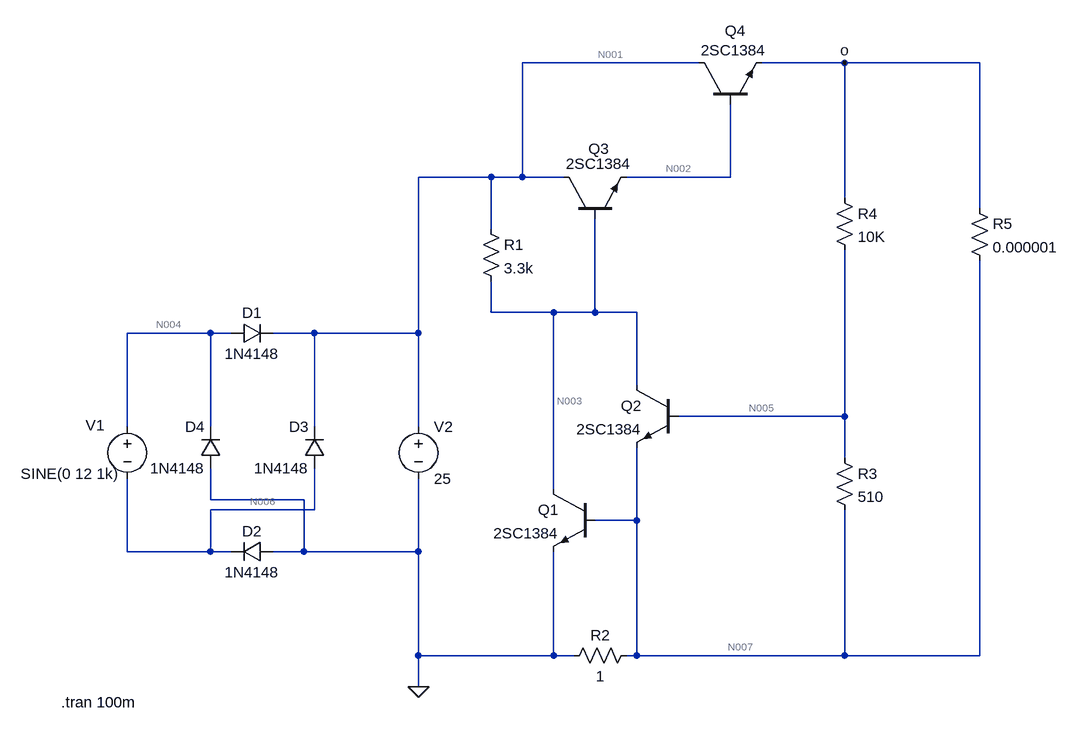
[diagram p0: schematic Draft2.asc]
Draft2.asc, the LTspice schematic file:
Version 4
SHEET 1 1492 680
WIRE 928 -416 656 -416
WIRE 1152 -416 1024 -416
WIRE 1360 -416 1152 -416
WIRE 608 -240 496 -240
WIRE 656 -240 656 -416
WIRE 656 -240 608 -240
WIRE 720 -240 656 -240
WIRE 976 -240 976 -352
WIRE 976 -240 816 -240
WIRE 1152 -208 1152 -416
WIRE 1360 -192 1360 -416
WIRE 608 -160 608 -240
WIRE 608 -32 608 -80
WIRE 704 -32 608 -32
WIRE 768 -32 768 -176
WIRE 768 -32 704 -32
WIRE 832 -32 768 -32
WIRE 176 0 48 0
WIRE 208 0 176 0
WIRE 336 0 272 0
WIRE 496 0 496 -240
WIRE 496 0 336 0
WIRE 832 80 832 -32
WIRE 1152 128 1152 -128
WIRE 1152 128 896 128
WIRE 48 144 48 0
WIRE 176 144 176 0
WIRE 336 144 336 0
WIRE 496 144 496 0
WIRE 1152 192 1152 128
WIRE 704 240 704 -32
WIRE 176 256 176 208
WIRE 320 256 176 256
WIRE 336 272 336 208
WIRE 336 272 176 272
WIRE 832 288 832 176
WIRE 832 288 768 288
WIRE 48 336 48 224
WIRE 176 336 176 272
WIRE 176 336 48 336
WIRE 208 336 176 336
WIRE 320 336 320 256
WIRE 320 336 272 336
WIRE 496 336 496 224
WIRE 496 336 320 336
WIRE 496 496 496 336
WIRE 704 496 704 336
WIRE 704 496 496 496
WIRE 736 496 704 496
WIRE 832 496 832 288
WIRE 832 496 816 496
WIRE 1152 496 1152 272
WIRE 1152 496 832 496
WIRE 1360 496 1360 -112
WIRE 1360 496 1152 496
WIRE 496 544 496 496
FLAG 496 544 0
FLAG 1152 -416 o
SYMBOL diode 208 16 R270
WINDOW 0 32 32 VTop 2
WINDOW 3 0 32 VBottom 2
SYMATTR InstName D1
SYMATTR Value 1N4148
SYMBOL diode 192 208 R180
WINDOW 0 24 64 Left 2
WINDOW 3 24 0 Left 2
SYMATTR InstName D4
SYMATTR Value 1N4148
SYMBOL diode 352 208 R180
WINDOW 0 24 64 Left 2
WINDOW 3 24 0 Left 2
SYMATTR InstName D3
SYMATTR Value 1N4148
SYMBOL diode 272 320 R90
WINDOW 0 0 32 VBottom 2
WINDOW 3 32 32 VTop 2
SYMATTR InstName D2
SYMATTR Value 1N4148
SYMBOL voltage 496 128 R0
WINDOW 123 0 0 Left 0
WINDOW 39 0 0 Left 0
SYMATTR InstName V2
SYMATTR Value 25
SYMBOL npn 720 -176 R270
WINDOW 0 108 38 VRight 2
WINDOW 3 85 3 VRight 2
SYMATTR InstName Q3
SYMATTR Value 2SC1384
SYMBOL res 592 -176 R0
SYMATTR InstName R1
SYMATTR Value 3.3k
SYMBOL res 832 480 R90
WINDOW 0 0 56 VBottom 2
WINDOW 3 32 56 VTop 2
SYMATTR InstName R2
SYMATTR Value 1
SYMBOL res 1136 176 R0
SYMATTR InstName R3
SYMATTR Value 510
SYMBOL npn 928 -352 R270
WINDOW 0 113 40 VRight 2
WINDOW 3 83 3 VRight 2
SYMATTR InstName Q4
SYMATTR Value 2SC1384
SYMBOL res 1136 -224 R0
SYMATTR InstName R4
SYMATTR Value 10K
SYMBOL voltage 48 128 R0
WINDOW 0 -64 14 Left 2
WINDOW 3 -164 88 Left 2
WINDOW 123 0 0 Left 0
WINDOW 39 0 0 Left 0
SYMATTR InstName V1
SYMATTR Value SINE(0 12 1k)
SYMBOL npn 768 240 M0
SYMATTR InstName Q1
SYMATTR Value 2SC1384
SYMBOL npn 896 80 M0
SYMATTR InstName Q2
SYMATTR Value 2SC1384
SYMBOL res 1344 -208 R0
SYMATTR InstName R5
SYMATTR Value 0.000001
TEXT -54 568 Left 2 !.tran 100m

The netlist it stands for:
* Draft2.asc
D1 N004 N001 1N4148
D4 0 N004 1N4148
D3 N006 N001 1N4148
D2 0 N006 1N4148
V2 N001 0 25
Q3 N001 N003 N002 0 2SC1384
R1 N001 N003 3.3k
R2 N007 0 1
R3 N005 N007 510
Q4 N001 N002 o 0 2SC1384
R4 o N005 10K
V1 N004 N006 SINE(0 12 1k)
Q1 N003 N007 0 0 2SC1384
Q2 N003 N005 N007 0 2SC1384
R5 o N007 0.000001
.model D D
.lib standard.dio
.model NPN NPN
.model PNP PNP
.lib standard.bjt
.tran 100m
.backanno
.end

* Results of the author's LTspice run, read from the files saved beside the schematic
* Operating Point, zero values left out:
*   V(n004) = 12.5 V
*   V(n001) = 25 V
*   V(n006) = 12.5 V
*   V(n003) = 2.091 V
*   V(n002) = 1.45 V
*   V(n007) = 664.5 mV
*   V(n005) = 664.5 mV
*   V(o) = 664.5 mV
*   Ic(Q3) = 3.368 mA
*   Ib(Q3) = 23.53 µA
*   Ie(Q3) = -3.391 mA
*   Ic(Q4) = 661.2 mA
*   Ib(Q4) = 3.391 mA
*   Ie(Q4) = -664.6 mA
*   Ic(Q1) = 6.919 mA
*   Ib(Q1) = 50.73 µA
*   Ie(Q1) = -6.969 mA
*   Ic(Q2) = 1.583 pA
*   Ib(Q2) = -1.535 pA
*   I(D1) = -2.532 nA
*   I(D4) = -2.532 nA
*   I(D3) = -2.532 nA
*   I(D2) = -2.532 nA
*   I(R1) = 6.942 mA
*   I(R2) = 664.5 mA
*   I(R3) = 64.69 pA
*   I(R4) = 63.16 pA
*   I(R5) = 664.6 mA
*   I(V2) = -671.5 mA
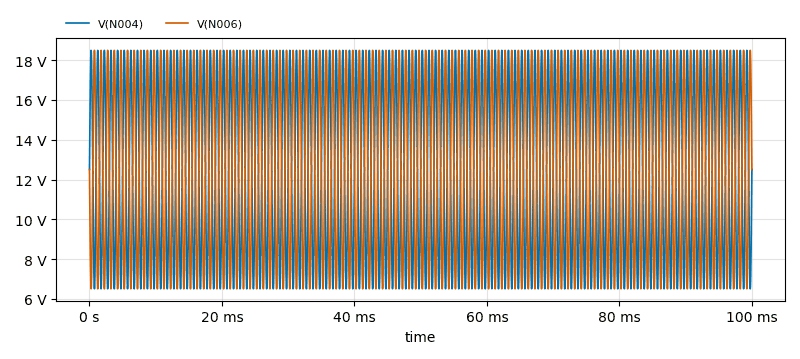
[diagram p1: Transient Analysis of Draft2.asc, plotted from the saved traces]
* Transient Analysis, 1 run:
*   V(N004): min 6.502 V, max 18.5 V, average 12.5 V, rms 13.22 V, last 12.5 V
*   V(N006): min 6.502 V, max 18.5 V, average 12.5 V, rms 13.22 V, last 12.5 V